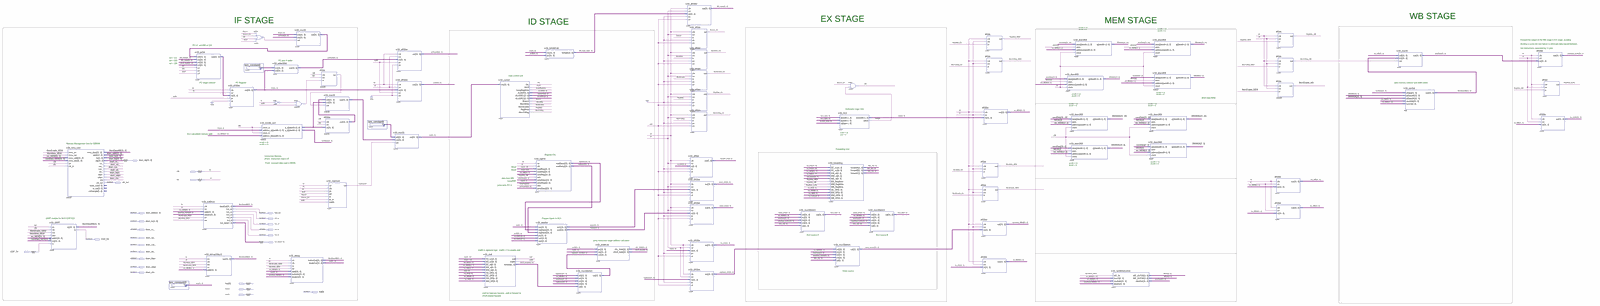
[diagram p0: schematic sheet, whole]
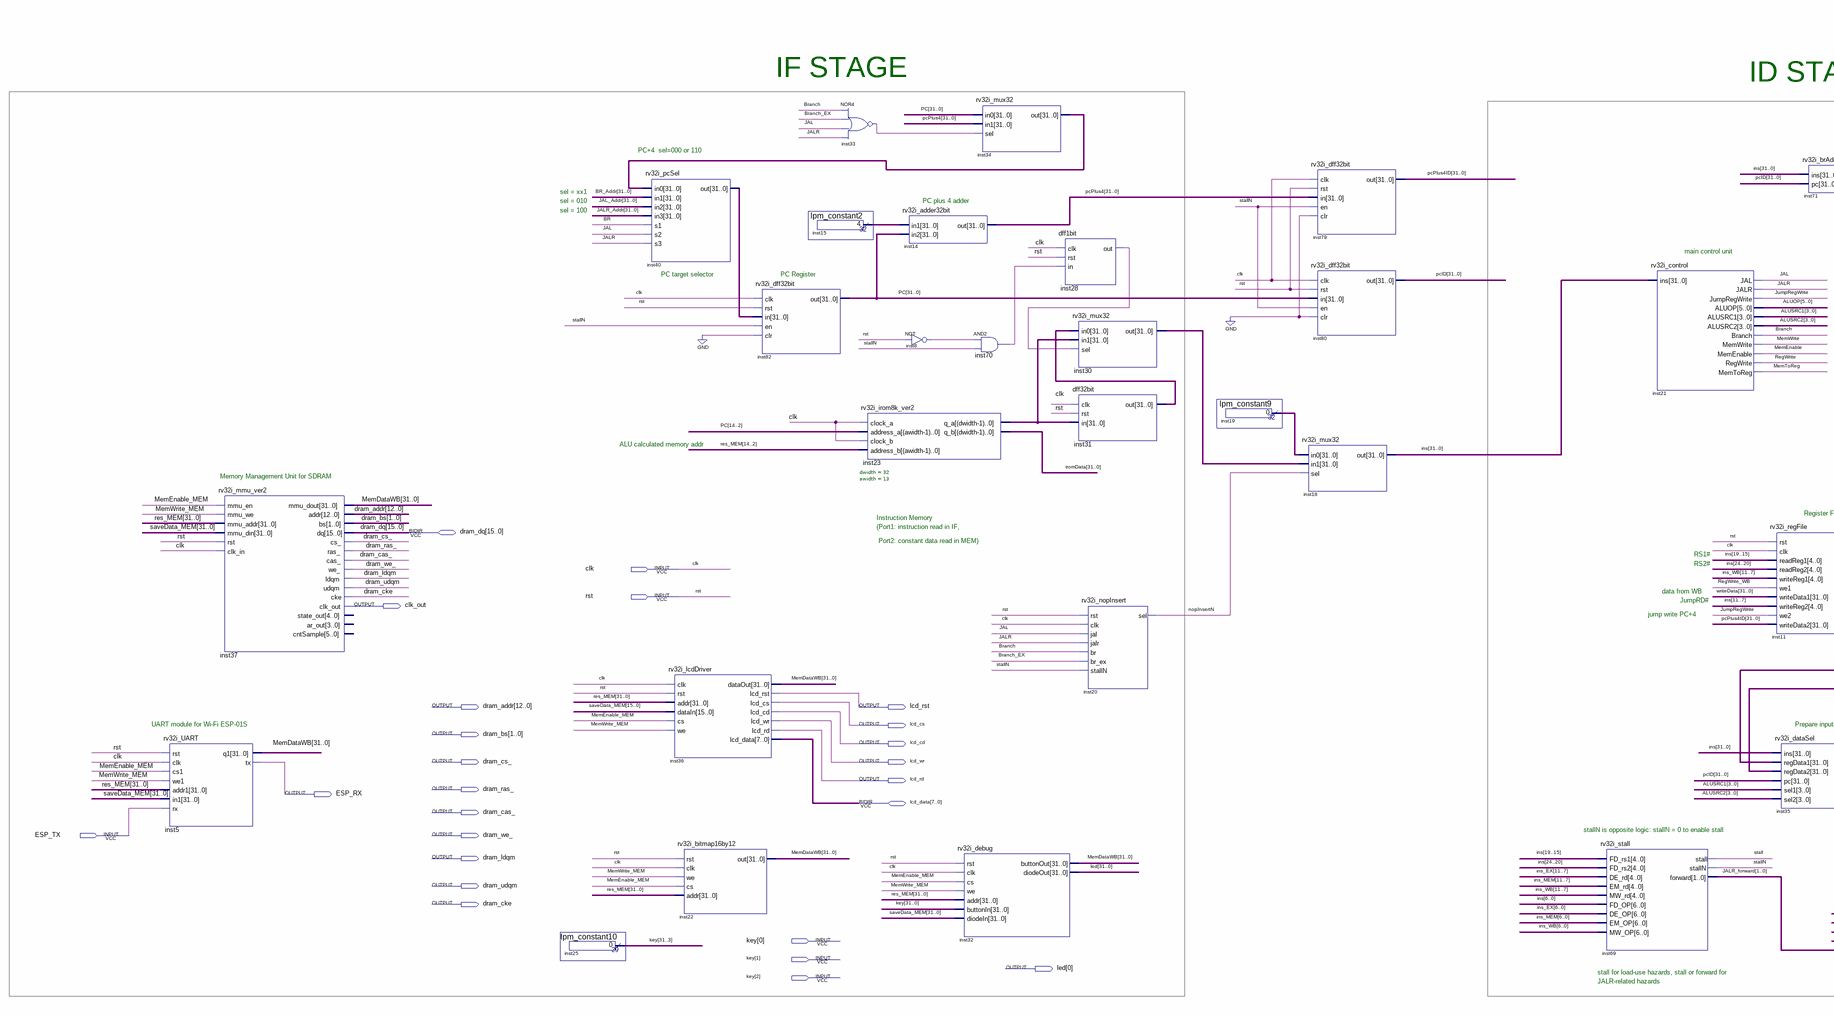
[diagram p1: schematic sheet, left part]
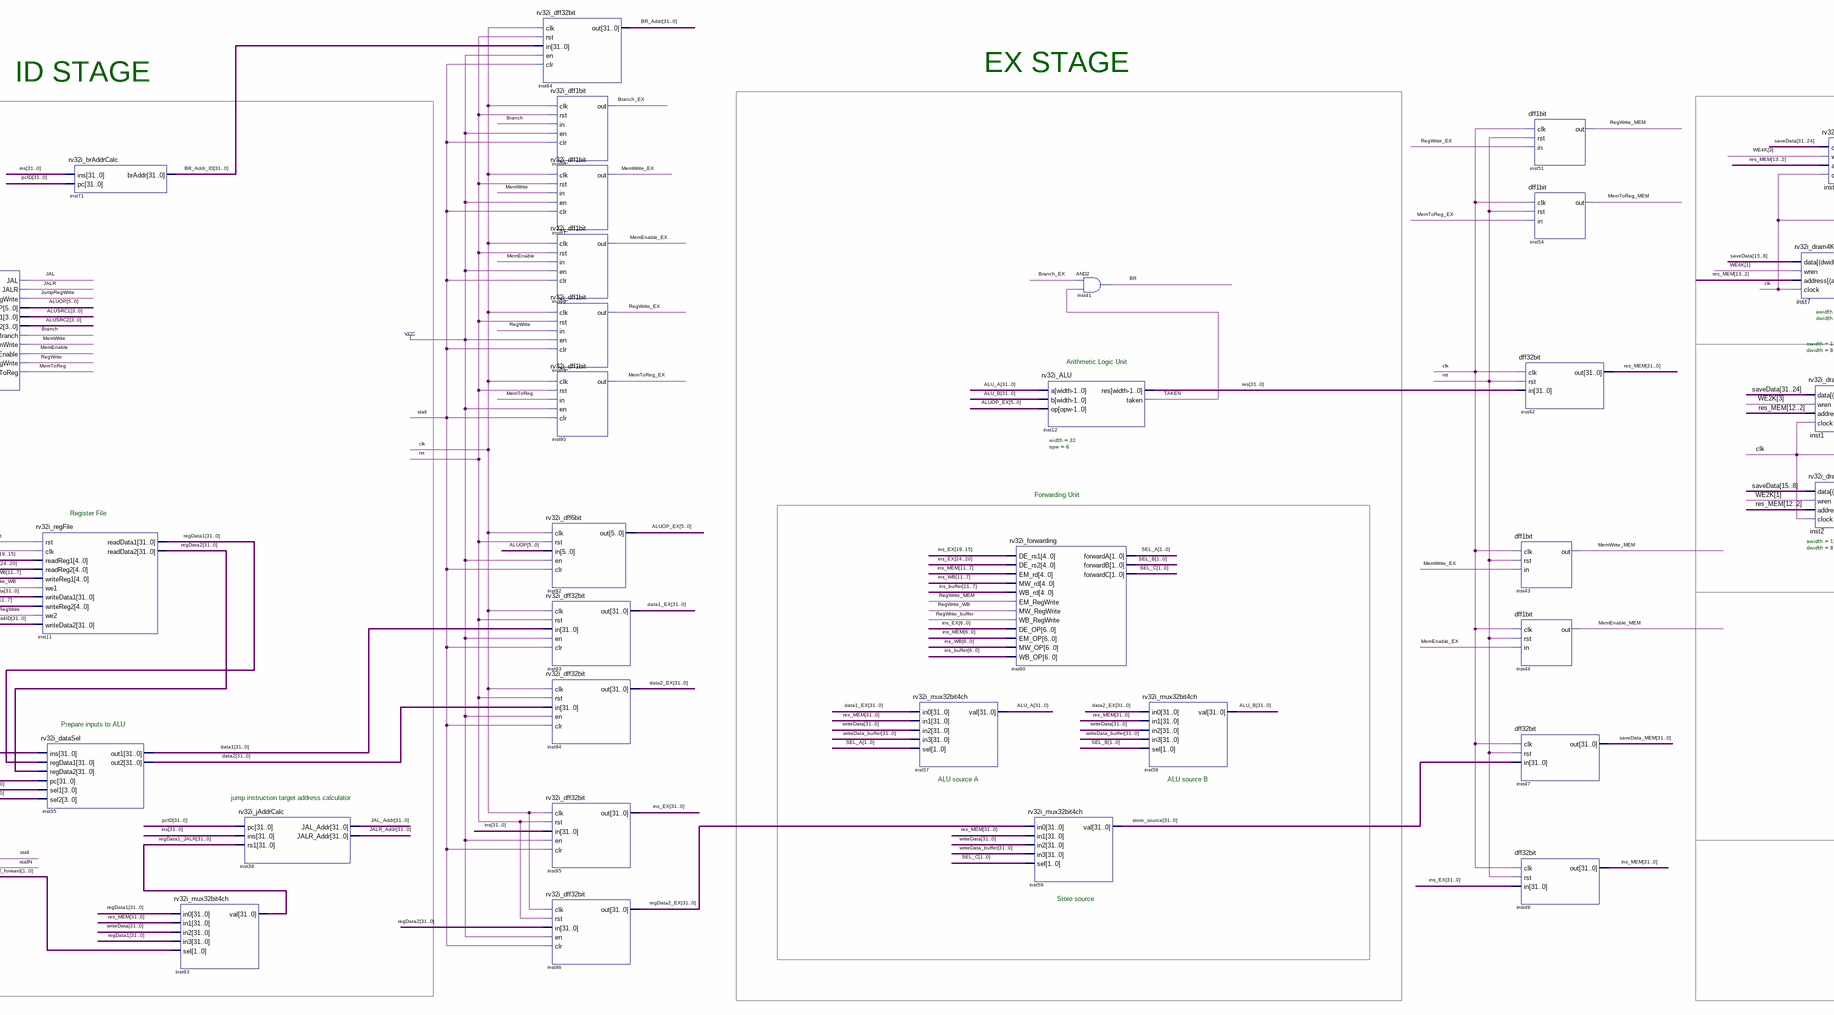
[diagram p2: schematic sheet, centre part]
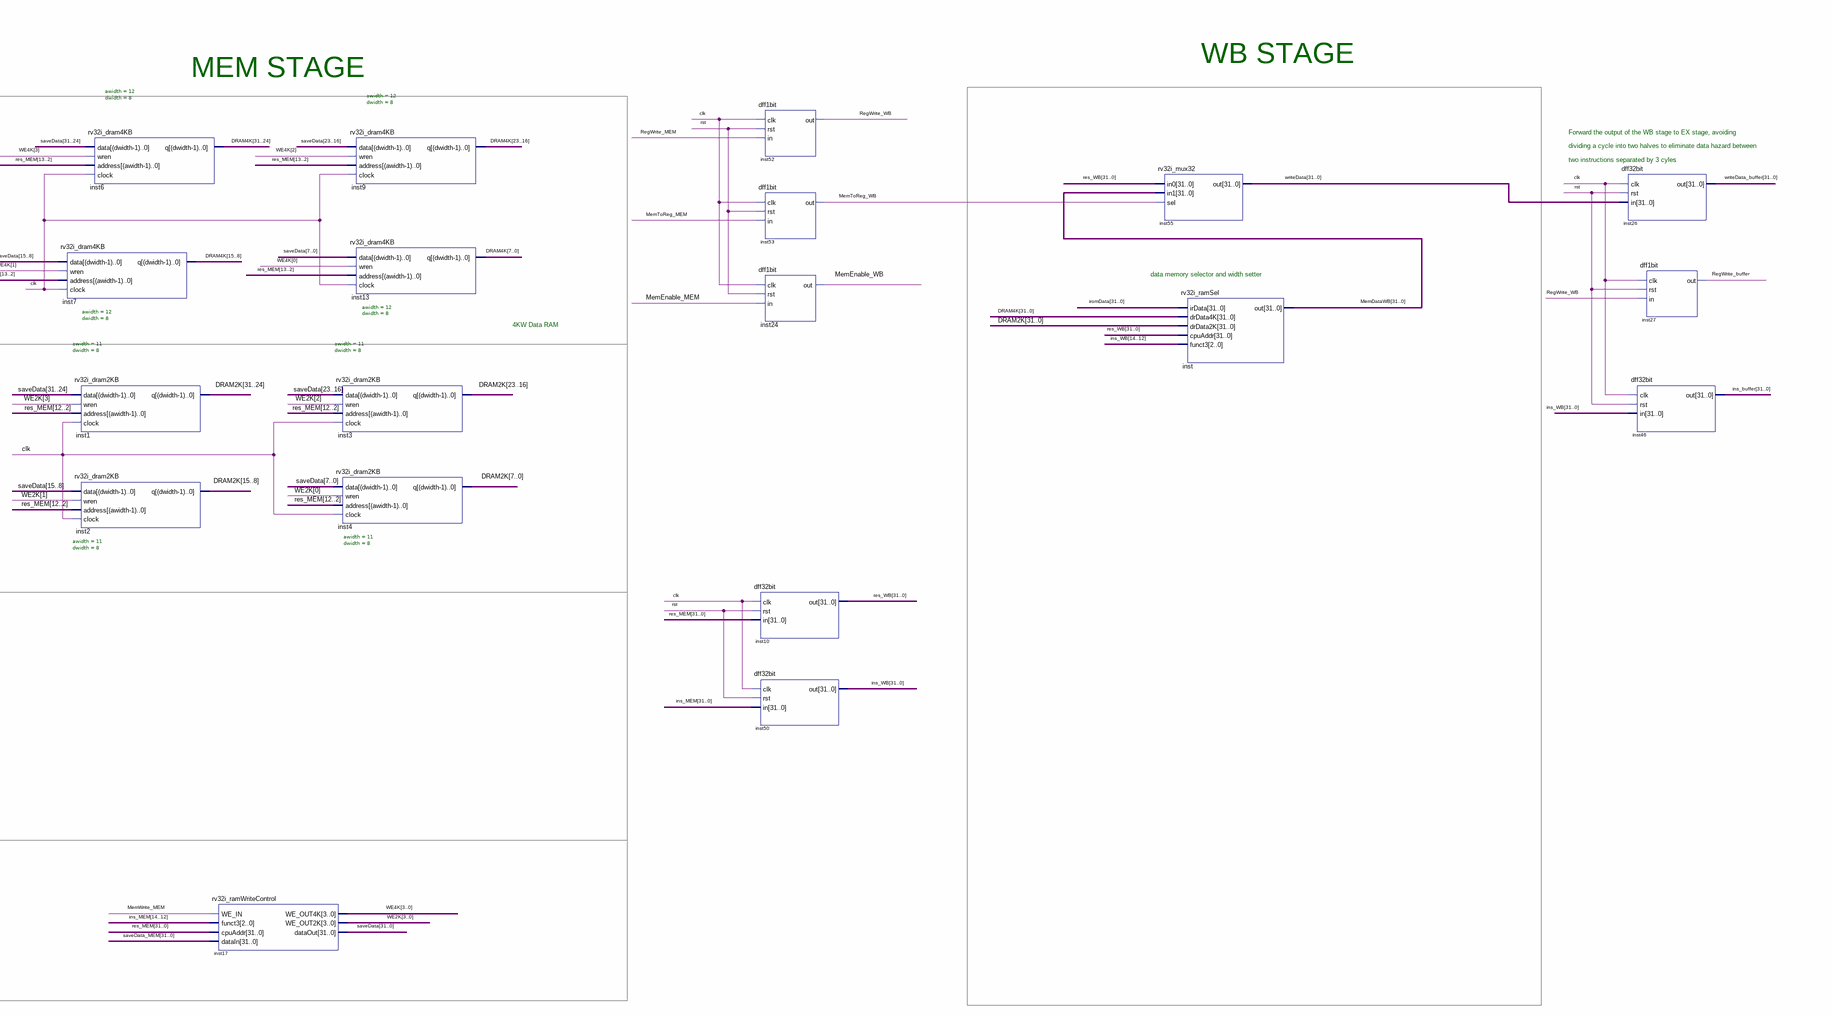
[diagram p3: schematic sheet, right part]
// Quartus schematic RV32I.bdf as structural Verilog: 73 symbols, 25 pins
module RV32I (
  input  clk,
  input  rst,
  input  ESP_TX,
  input  [31:0] key,
  inout  [15:0] dram_dq,
  inout  [7:0] lcd_data,
  output clk_out,
  output [12:0] dram_addr,
  output lcd_rst,
  output lcd_cs,
  output [1:0] dram_bs,
  output lcd_cd,
  output dram_cs_,
  output lcd_wr,
  output lcd_rd,
  output dram_ras_,
  output ESP_RX,
  output dram_cas_,
  output dram_we_,
  output dram_ldqm,
  output dram_udqm,
  output dram_cke,
  output [31:0] led
);

  wire BR, Branch, Branch_EX, inst8_out, inst28_out, inst33_out, inst70_out, JAL, JALR, JumpRegWrite,
       MemEnable, MemEnable_EX, MemEnable_MEM, MemEnable_WB, MemToReg, MemToReg_EX, MemToReg_MEM,
       MemToReg_WB, MemWrite, MemWrite_EX, MemWrite_MEM, nopInsertN, RegWrite, RegWrite_buffer, RegWrite_EX,
       RegWrite_MEM, RegWrite_WB, stall, stallN, TAKEN;
  wire [1:0] JALR_forward, SEL_A, SEL_B, SEL_C;
  wire [3:0] ALUSRC1, ALUSRC2, WE2K, WE4K;
  wire [5:0] ALUOP, ALUOP_EX;
  wire [31:0] ALU_A, ALU_B, BR_Addr, BR_Addr_ID, data1, data1_EX, data2, data2_EX, DRAM2K, DRAM4K, ins,
       ins_buffer, ins_EX, ins_MEM, ins_WB, inst15_result, inst19_result, inst23_q_a, inst30_out, inst31_out,
       inst34_out, inst40_out, iromData, JAL_Addr, JALR_Addr, MemDataWB, PC, pcID, pcPlus4, pcPlus4ID,
       regData1, regData1_JALR, regData2, regData2_EX, res, res_MEM, res_WB, saveData, saveData_MEM,
       store_source, writeData, writeData_buffer;

  rv32i_UART inst5 (
    .rst(rst), .clk(clk), .cs1(MemEnable_MEM), .we1(MemWrite_MEM), .addr1(res_MEM), .in1(saveData_MEM),
    .rx(ESP_TX), .q1(MemDataWB), .tx(ESP_RX));
  rv32i_mmu_ver2 inst37 (
    .mmu_en(MemEnable_MEM), .mmu_we(MemWrite_MEM), .mmu_addr(res_MEM), .mmu_din(saveData_MEM), .rst(rst),
    .clk_in(clk), .mmu_dout(MemDataWB), .addr(dram_addr), .bs(dram_bs), .cs_(dram_cs_), .ras_(dram_ras_),
    .cas_(dram_cas_), .we_(dram_we_), .ldqm(dram_ldqm), .udqm(dram_udqm), .cke(dram_cke), .clk_out(clk_out),
    .dq(dram_dq));  // open: state_out, ar_out, cntSample
  lpm_constant10 inst25 (.result(key[31:3]));
  rv32i_pcSel inst40 (
    .in0(inst34_out), .in1(BR_Addr), .in2(JAL_Addr), .in3(JALR_Addr), .s1(BR), .s2(JAL), .s3(JALR),
    .out(inst40_out));
  rv32i_lcdDriver inst36 (
    .clk(clk), .rst(rst), .addr(res_MEM), .dataIn(saveData_MEM[15:0]), .cs(MemEnable_MEM), .we(MemWrite_MEM),
    .dataOut(MemDataWB), .lcd_rst(lcd_rst), .lcd_cs(lcd_cs), .lcd_cd(lcd_cd), .lcd_wr(lcd_wr),
    .lcd_rd(lcd_rd), .lcd_data(lcd_data));
  rv32i_bitmap16by12 inst22 (
    .rst(rst), .clk(clk), .we(MemWrite_MEM), .cs(MemEnable_MEM), .addr(res_MEM), .out(MemDataWB));
  rv32i_dff32bit inst82 (.clk(clk), .rst(rst), .in(inst40_out), .en(stallN), .clr(1'b0), .out(PC));
  nor inst33 (inst33_out, Branch, Branch_EX, JAL, JALR);
  lpm_constant2 inst15 (.result(inst15_result));
  rv32i_irom8k_ver2 #(.dwidth(32), .awidth(13)) inst23 (
    .clock_a(clk), .address_a(PC[14:2]), .clock_b(clk), .address_b(res_MEM[14:2]), .q_a(inst23_q_a),
    .q_b(iromData));
  rv32i_adder32bit inst14 (.in1(inst15_result), .in2(PC), .out(pcPlus4));
  not inst8 (inst8_out, rst);
  rv32i_mux32 inst34 (.in0(PC), .in1(pcPlus4), .sel(inst33_out), .out(inst34_out));
  and inst70 (inst70_out, inst8_out, stallN);
  rv32i_debug inst32 (
    .rst(rst), .clk(clk), .cs(MemEnable_MEM), .we(MemWrite_MEM), .addr(res_MEM), .buttonIn(key),
    .diodeIn(saveData_MEM), .buttonOut(MemDataWB), .diodeOut(led));
  dff1bit inst28 (.clk(clk), .rst(rst), .in(inst70_out), .out(inst28_out));
  rv32i_mux32 inst30 (.in0(inst31_out), .in1(inst23_q_a), .sel(inst28_out), .out(inst30_out));
  dff32bit inst31 (.clk(clk), .rst(rst), .in(inst23_q_a), .out(inst31_out));
  rv32i_nopInsert inst20 (
    .rst(rst), .clk(clk), .jal(JAL), .jalr(JALR), .br(Branch), .br_ex(Branch_EX), .stallN(stallN),
    .sel(nopInsertN));
  lpm_constant9 inst19 (.result(inst19_result));
  rv32i_dff32bit inst79 (.clk(clk), .rst(rst), .in(pcPlus4), .en(stallN), .clr(1'b0), .out(pcPlus4ID));
  rv32i_dff32bit inst80 (.clk(clk), .rst(rst), .in(PC), .en(stallN), .clr(1'b0), .out(pcID));
  rv32i_mux32 inst18 (.in0(inst19_result), .in1(inst30_out), .sel(nopInsertN), .out(ins));
  rv32i_stall inst69 (
    .FD_rs1(ins[19:15]), .FD_rs2(ins[24:20]), .DE_rd(ins_EX[11:7]), .EM_rd(ins_MEM[11:7]),
    .MW_rd(ins_WB[11:7]), .FD_OP(ins[6:0]), .DE_OP(ins_EX[6:0]), .EM_OP(ins_MEM[6:0]), .MW_OP(ins_WB[6:0]),
    .stall(stall), .stallN(stallN), .forward(JALR_forward));
  rv32i_control inst21 (
    .ins(ins), .JAL(JAL), .JALR(JALR), .JumpRegWrite(JumpRegWrite), .ALUOP(ALUOP), .ALUSRC1(ALUSRC1),
    .ALUSRC2(ALUSRC2), .Branch(Branch), .MemWrite(MemWrite), .MemEnable(MemEnable), .RegWrite(RegWrite),
    .MemToReg(MemToReg));
  rv32i_regFile inst11 (
    .rst(rst), .clk(clk), .readReg1(ins[19:15]), .readReg2(ins[24:20]), .writeReg1(ins_WB[11:7]),
    .we1(RegWrite_WB), .writeData1(writeData), .writeReg2(ins[11:7]), .we2(JumpRegWrite),
    .writeData2(pcPlus4ID), .readData1(regData1), .readData2(regData2));
  rv32i_dataSel inst35 (
    .ins(ins), .regData1(regData1), .regData2(regData2), .pc(pcID), .sel1(ALUSRC1), .sel2(ALUSRC2),
    .out1(data1), .out2(data2));
  rv32i_brAddrCalc inst71 (.ins(ins), .pc(pcID), .brAddr(BR_Addr_ID));
  rv32i_mux32bit4ch inst63 (
    .in0(regData1), .in1(res_MEM), .in2(writeData), .in3(regData1), .sel(JALR_forward), .val(regData1_JALR));
  rv32i_jAddrCalc inst39 (.pc(pcID), .ins(ins), .rs1(regData1_JALR), .JAL_Addr(JAL_Addr), .JALR_Addr(JALR_Addr));
  rv32i_dff32bit inst84 (.clk(clk), .rst(rst), .in(BR_Addr_ID), .en(1'b1), .clr(stall), .out(BR_Addr));
  rv32i_dff1bit inst86 (.clk(clk), .rst(rst), .in(Branch), .en(1'b1), .clr(stall), .out(Branch_EX));
  rv32i_dff1bit inst87 (.clk(clk), .rst(rst), .in(MemWrite), .en(1'b1), .clr(stall), .out(MemWrite_EX));
  rv32i_dff1bit inst88 (.clk(clk), .rst(rst), .in(MemEnable), .en(1'b1), .clr(stall), .out(MemEnable_EX));
  rv32i_dff1bit inst89 (.clk(clk), .rst(rst), .in(RegWrite), .en(1'b1), .clr(stall), .out(RegWrite_EX));
  rv32i_dff1bit inst90 (.clk(clk), .rst(rst), .in(MemToReg), .en(1'b1), .clr(stall), .out(MemToReg_EX));
  rv32i_dff6bit inst92 (.clk(clk), .rst(rst), .in(ALUOP), .en(1'b1), .clr(stall), .out(ALUOP_EX));
  rv32i_dff32bit inst93 (.clk(clk), .rst(rst), .in(data1), .en(1'b1), .clr(stall), .out(data1_EX));
  rv32i_dff32bit inst94 (.clk(clk), .rst(rst), .in(data2), .en(1'b1), .clr(stall), .out(data2_EX));
  rv32i_dff32bit inst95 (.clk(clk), .rst(rst), .in(ins), .en(1'b1), .clr(stall), .out(ins_EX));
  rv32i_dff32bit inst96 (.clk(clk), .rst(rst), .in(regData2), .en(1'b1), .clr(stall), .out(regData2_EX));
  rv32i_mux32bit4ch inst57 (
    .in0(data1_EX), .in1(res_MEM), .in2(writeData), .in3(writeData_buffer), .sel(SEL_A), .val(ALU_A));
  rv32i_forwarding inst60 (
    .DE_rs1(ins_EX[19:15]), .DE_rs2(ins_EX[24:20]), .EM_rd(ins_MEM[11:7]), .MW_rd(ins_WB[11:7]),
    .WB_rd(ins_buffer[11:7]), .EM_RegWrite(RegWrite_MEM), .MW_RegWrite(RegWrite_WB),
    .WB_RegWrite(RegWrite_buffer), .DE_OP(ins_EX[6:0]), .EM_OP(ins_MEM[6:0]), .MW_OP(ins_WB[6:0]),
    .WB_OP(ins_buffer[6:0]), .forwardA(SEL_A), .forwardB(SEL_B), .forwardC(SEL_C));
  rv32i_ALU #(.width(32), .opw(6)) inst12 (.a(ALU_A), .b(ALU_B), .op(ALUOP_EX), .res(res), .taken(TAKEN));
  rv32i_mux32bit4ch inst59 (
    .in0(regData2_EX), .in1(res_MEM), .in2(writeData), .in3(writeData_buffer), .sel(SEL_C), .val(store_source));
  and inst41 (BR, Branch_EX, TAKEN);
  rv32i_mux32bit4ch inst58 (
    .in0(data2_EX), .in1(res_MEM), .in2(writeData), .in3(writeData_buffer), .sel(SEL_B), .val(ALU_B));
  dff1bit inst51 (.clk(clk), .rst(rst), .in(RegWrite_EX), .out(RegWrite_MEM));
  dff1bit inst54 (.clk(clk), .rst(rst), .in(MemToReg_EX), .out(MemToReg_MEM));
  dff32bit inst42 (.clk(clk), .rst(rst), .in(res), .out(res_MEM));
  dff1bit inst43 (.clk(clk), .rst(rst), .in(MemWrite_EX), .out(MemWrite_MEM));
  dff1bit inst44 (.clk(clk), .rst(rst), .in(MemEnable_EX), .out(MemEnable_MEM));
  dff32bit inst47 (.clk(clk), .rst(rst), .in(store_source), .out(saveData_MEM));
  dff32bit inst49 (.clk(clk), .rst(rst), .in(ins_EX), .out(ins_MEM));
  rv32i_dram4KB #(.awidth(12), .dwidth(8)) inst6 (
    .data(saveData[31:24]), .wren(WE4K[3]), .address(res_MEM[13:2]), .clock(clk), .q(DRAM4K[31:24]));
  rv32i_dram4KB #(.awidth(12), .dwidth(8)) inst7 (
    .data(saveData[15:8]), .wren(WE4K[1]), .address(res_MEM[13:2]), .clock(clk), .q(DRAM4K[15:8]));
  rv32i_dram2KB #(.awidth(11), .dwidth(8)) inst1 (
    .data(saveData[31:24]), .wren(WE2K[3]), .address(res_MEM[12:2]), .clock(clk), .q(DRAM2K[31:24]));
  rv32i_dram2KB #(.awidth(11), .dwidth(8)) inst2 (
    .data(saveData[15:8]), .wren(WE2K[1]), .address(res_MEM[12:2]), .clock(clk), .q(DRAM2K[15:8]));
  rv32i_ramWriteControl inst17 (
    .WE_IN(MemWrite_MEM), .funct3(ins_MEM[14:12]), .cpuAddr(res_MEM), .dataIn(saveData_MEM), .WE_OUT4K(WE4K),
    .WE_OUT2K(WE2K), .dataOut(saveData));
  rv32i_dram4KB #(.awidth(12), .dwidth(8)) inst9 (
    .data(saveData[23:16]), .wren(WE4K[2]), .address(res_MEM[13:2]), .clock(clk), .q(DRAM4K[23:16]));
  rv32i_dram4KB #(.awidth(12), .dwidth(8)) inst13 (
    .data(saveData[7:0]), .wren(WE4K[0]), .address(res_MEM[13:2]), .clock(clk), .q(DRAM4K[7:0]));
  rv32i_dram2KB #(.awidth(11), .dwidth(8)) inst3 (
    .data(saveData[23:16]), .wren(WE2K[2]), .address(res_MEM[12:2]), .clock(clk), .q(DRAM2K[23:16]));
  rv32i_dram2KB #(.awidth(11), .dwidth(8)) inst4 (
    .data(saveData[7:0]), .wren(WE2K[0]), .address(res_MEM[12:2]), .clock(clk), .q(DRAM2K[7:0]));
  dff32bit inst10 (.clk(clk), .rst(rst), .in(res_MEM), .out(res_WB));
  dff32bit inst50 (.clk(clk), .rst(rst), .in(ins_MEM), .out(ins_WB));
  dff1bit inst52 (.clk(clk), .rst(rst), .in(RegWrite_MEM), .out(RegWrite_WB));
  dff1bit inst53 (.clk(clk), .rst(rst), .in(MemToReg_MEM), .out(MemToReg_WB));
  dff1bit inst24 (.clk(clk), .rst(rst), .in(MemEnable_MEM), .out(MemEnable_WB));
  rv32i_mux32 inst55 (.in0(res_WB), .in1(MemDataWB), .sel(MemToReg_WB), .out(writeData));
  rv32i_ramSel inst (
    .irData(iromData), .drData4K(DRAM4K), .drData2K(DRAM2K), .cpuAddr(res_WB), .funct3(ins_WB[14:12]),
    .out(MemDataWB));
  dff32bit inst26 (.clk(clk), .rst(rst), .in(writeData), .out(writeData_buffer));
  dff32bit inst46 (.clk(clk), .rst(rst), .in(ins_WB), .out(ins_buffer));
  dff1bit inst27 (.clk(clk), .rst(rst), .in(RegWrite_WB), .out(RegWrite_buffer));

  // Notes on the sheet:
  //   WB STAGE
  //   EX STAGE
  //   IF STAGE
  //   MEM STAGE
  //   ID STAGE
  //   Forward the output of the WB stage to EX stage, avoiding
  //   dividing a cycle into two halves to eliminate data hazard between 
  //   PC+4  sel=000 or 110  
  //   two instructions separated by 3 cyles
  //   sel = xx1
  //   sel = 010 
  //   PC plus 4 adder 
  //   sel = 100 
  //   main control unit  
  //   PC target selector 
  //   PC Register 
  //   data memory selector and width setter  
  //   4KW Data RAM
  //   Arithmetic Logic Unit  
  //   ALU calculated memory addr 
  //   Memory Management Unit for SDRAM
  //   Forwarding Unit
  //   Register File 
  //   Instruction Memory 
  //   (Port1: instruction read in IF,
  //    Port2: constant data read in MEM)   
  //   RS1#
  //   RS2#
  //   data from WB
  //   JumpRD#
  //   jump write PC+4  
  //   UART module for Wi-Fi ESP-01S
  //   Prepare inputs to ALU 
  //   ALU source A
  //   ALU source B
  //   jump instruction target address calculator 
  //   stallN is opposite logic: stallN = 0 to enable stall      
  //   Store source
  //   stall for load-use hazards, stall or forward for 
  //   JALR-related hazards
endmodule
